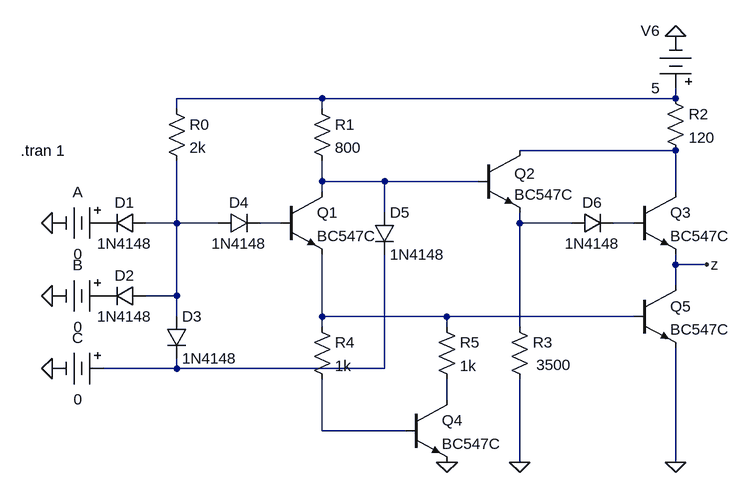
[diagram p0: schematic Draft14.asc]
Draft14.asc, the LTspice schematic file:
Version 4
SHEET 1 880 680
WIRE 208 -144 -16 -144
WIRE 752 -144 752 -160
WIRE 752 -144 208 -144
WIRE -16 -128 -16 -144
WIRE 208 -128 208 -144
WIRE 752 -64 512 -64
WIRE 208 -16 208 -48
WIRE 304 -16 208 -16
WIRE 448 -16 304 -16
WIRE 208 0 208 -16
WIRE 752 0 752 -64
WIRE 304 32 304 -16
WIRE -16 48 -16 -48
WIRE -16 48 -64 48
WIRE 48 48 -16 48
WIRE 144 48 112 48
WIRE 512 48 512 32
WIRE 592 48 512 48
WIRE 688 48 656 48
WIRE 752 112 752 96
WIRE 800 112 752 112
WIRE 752 144 752 112
WIRE -16 160 -16 48
WIRE -16 160 -64 160
WIRE -16 192 -16 160
WIRE 208 192 208 96
WIRE 400 192 208 192
WIRE 688 192 400 192
WIRE 208 208 208 192
WIRE 400 208 400 192
WIRE 512 208 512 48
WIRE -16 272 -16 256
WIRE -16 272 -128 272
WIRE 304 272 304 96
WIRE 304 272 -16 272
WIRE 400 320 400 288
WIRE 208 368 208 288
WIRE 336 368 208 368
WIRE 512 416 512 288
WIRE 752 416 752 240
FLAG -208 48 0
FLAG -208 160 0
FLAG -208 272 0
FLAG 752 -240 0
FLAG 400 416 0
FLAG 512 416 0
FLAG 752 416 0
FLAG 800 112 z
SYMBOL diode -64 32 R90
WINDOW 0 0 32 VBottom 2
WINDOW 3 32 32 VTop 2
SYMATTR InstName D1
SYMATTR Value 1N4148
SYMBOL diode -64 144 R90
WINDOW 0 0 32 VBottom 2
WINDOW 3 32 32 VTop 2
SYMATTR InstName D2
SYMATTR Value 1N4148
SYMBOL diode -32 192 R0
SYMATTR InstName D3
SYMATTR Value 1N4148
SYMBOL diode 48 64 R270
WINDOW 0 32 32 VTop 2
WINDOW 3 0 32 VBottom 2
SYMATTR InstName D4
SYMATTR Value 1N4148
SYMBOL diode 288 32 R0
SYMATTR InstName D5
SYMATTR Value 1N4148
SYMBOL diode 592 64 R270
WINDOW 0 32 32 VTop 2
WINDOW 3 0 32 VBottom 2
SYMATTR InstName D6
SYMATTR Value 1N4148
SYMBOL res 192 -144 R0
SYMATTR InstName R1
SYMATTR Value 800
SYMBOL res 736 -160 R0
SYMATTR InstName R2
SYMATTR Value 120
SYMBOL res 496 192 R0
WINDOW 3 42 74 Left 2
SYMATTR InstName R3
SYMATTR Value 3500
SYMBOL res 192 192 R0
SYMATTR InstName R4
SYMATTR Value 1k
SYMBOL res 384 192 R0
SYMATTR InstName R5
SYMATTR Value 1k
SYMBOL res -32 -144 R0
SYMATTR InstName R0
SYMATTR Value 2k
SYMBOL npn 144 0 R0
SYMATTR InstName Q1
SYMATTR Value BC547C
SYMBOL npn 448 -64 R0
WINDOW 0 56 36 Left 2
SYMATTR InstName Q2
SYMATTR Value BC547C
SYMBOL npn 688 0 R0
SYMATTR InstName Q3
SYMATTR Value BC547C
SYMBOL npn 336 320 R0
SYMATTR InstName Q4
SYMATTR Value BC547C
SYMBOL npn 688 144 R0
SYMATTR InstName Q5
SYMATTR Value BC547C
SYMBOL Misc\\battery -112 48 R90
WINDOW 0 -32 56 VBottom 2
WINDOW 3 32 56 VTop 2
WINDOW 123 0 0 Left 0
WINDOW 39 0 0 Left 0
SYMATTR InstName A
SYMATTR Value 0
SYMBOL Misc\\battery -112 160 R90
WINDOW 0 -32 56 VBottom 2
WINDOW 3 32 56 VTop 2
WINDOW 123 0 0 Left 0
WINDOW 39 0 0 Left 0
SYMATTR InstName B
SYMATTR Value 0
SYMBOL Misc\\battery -112 272 R90
WINDOW 0 -32 56 VBottom 2
WINDOW 3 32 56 VTop 2
WINDOW 123 0 0 Left 0
WINDOW 39 0 0 Left 0
SYMATTR InstName C
SYMATTR Value 0
SYMBOL Misc\\battery 752 -144 R180
WINDOW 0 24 104 Left 2
WINDOW 3 24 16 Left 2
WINDOW 123 0 0 Left 0
WINDOW 39 0 0 Left 0
SYMATTR InstName V6
SYMATTR Value 5
TEXT -256 -64 Left 2 !.tran 1

The netlist it stands for:
* Draft14.asc
D1 N004 P001 1N4148
D2 N004 P002 1N4148
D3 N004 N009 1N4148
D4 N004 N005 1N4148
D5 N003 N009 1N4148
D6 N006 N007 1N4148
R1 N001 N003 800
R2 N001 N002 120
R3 N006 0 3500
R4 N008 N011 1k
R5 N008 N010 1k
R0 N001 N004 2k
Q1 N003 N005 N008 0 BC547C
Q2 N002 N003 N006 0 BC547C
Q3 N002 N007 z 0 BC547C
Q4 N010 N011 0 0 BC547C
Q5 z N008 0 0 BC547C
V§A P001 0 0
V§B P002 0 0
V§C N009 0 0
V6 N001 0 5
.model D D
.lib standard.dio
.model NPN NPN
.model PNP PNP
.lib standard.bjt
.tran 1
.backanno
.end